# Altium schematic sheet Interface.SchDoc
size A4
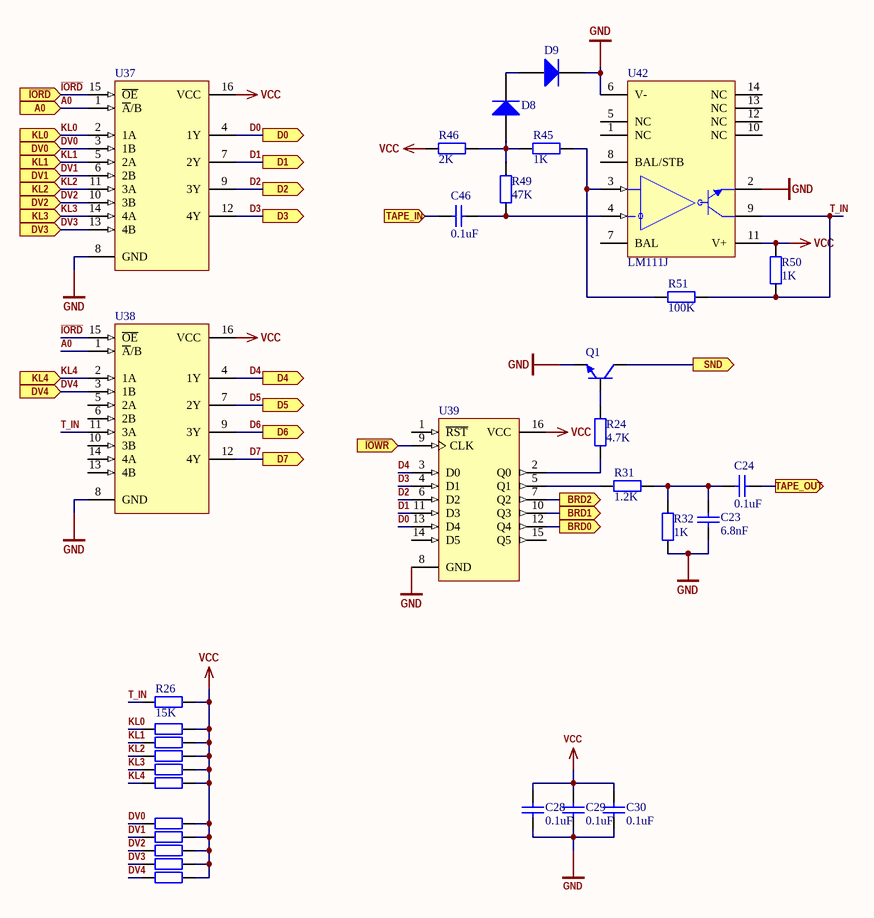
[diagram p0: Interface.SchDoc]

## Parts
C23  value 6.8nF  [RAD-0.3]  (hidden comment: Cap)
C24  value 0.1uF  [RAD-0.3]  (hidden comment: Cap)
C28  value 0.1uF  [RAD-0.3]  (hidden comment: Cap)
C29  value 0.1uF  [RAD-0.3]  (hidden comment: Cap)
C30  value 0.1uF  [RAD-0.3]  (hidden comment: Cap)
C46  value 0.1uF  [RAD-0.3]  (hidden comment: Cap)
D8  Diode 1N4148  [DO-35]  (value not drawn)
D9  Diode 1N4148  [DO-35]  (value not drawn)
Q1  KT315  [D35]  (value not drawn)
R24  value 4.7K  [AXIAL-0.4]  (hidden comment: Res2)
R26  value 15K  [AXIAL-0.4]  (hidden comment: Res2)
R27  Res2  [AXIAL-0.4]  (value not drawn)
R28  Res2  [AXIAL-0.4]  (value not drawn)
R29  Res2  [AXIAL-0.4]  (value not drawn)
R30  Res2  [AXIAL-0.4]  (value not drawn)
R31  value 1.2K  [AXIAL-0.4]  (hidden comment: Res2)
R32  value 1K  [AXIAL-0.4]  (hidden comment: Res2)
R33  Res2  [AXIAL-0.4]  (value not drawn)
R36  Res2  [AXIAL-0.4]  (value not drawn)
R38  Res2  [AXIAL-0.4]  (value not drawn)
R40  Res2  [AXIAL-0.4]  (value not drawn)
R42  Res2  [AXIAL-0.4]  (value not drawn)
R44  Res2  [AXIAL-0.4]  (value not drawn)
R45  value 1K  [AXIAL-0.4]  (hidden comment: Res2)
R46  value 2K  [AXIAL-0.4]  (hidden comment: Res2)
R49  value 47K  [AXIAL-0.4]  (hidden comment: Res2)
R50  value 1K  [AXIAL-0.4]  (hidden comment: Res2)
R51  value 100K  [AXIAL-0.4]  (hidden comment: Res2)
U37  (no value)  [N016]
U38  (no value)  [N016]
U39  (no value)  [N016]
U42  LM111J  [J014]

## Ports
A0 (in), BRD0 (out), BRD1 (out), BRD2 (out), D0 (out), D1 (out), D2 (out), D3 (out), D4 (out), D5 (out), D6 (out), D7 (out), DV0 (in), DV1 (in), DV2 (in), DV3 (in), DV4 (in), KL0 (in), KL1 (in), KL2 (in), KL3 (in), KL4 (in), SND (out), TAPE_IN (in), TAPE_OUT (out), ~{IORD} (in), ~{IOWR} (in)

## Nets
GND: C23.1 C28.1 C29.1 C30.1 D9.2(K) Q1.1(E) R32.1 U37.8(GND) U38.8(GND) U39.8(GND) U42.2(EM_OUT) U42.6(V-)
VCC: C28.2 C29.2 C30.2 R26.2 R27.2 R28.2 R29.2 R30.2 R33.2 R36.2 R38.2 R40.2 R42.2 R44.2 R46.2 R50.2 U37.16(VCC) U38.16(VCC) U39.16(VCC) U42.11(V+)
A0: U37.1(~{A}/B) U38.1(~{A}/B) ; port A0
BRD0: U39.12(Q4) ; port BRD0
BRD1: U39.10(Q3) ; port BRD1
BRD2: U39.7(Q2) ; port BRD2
D0: U37.4(1Y) U39.13(D4) ; port D0
D1: U37.7(2Y) U39.11(D3) ; port D1
D2: U37.9(3Y) U39.6(D2) ; port D2
D3: U37.12(4Y) U39.4(D1) ; port D3
D4: U38.4(1Y) U39.3(D0) ; port D4
D5: U38.7(2Y) ; port D5
D6: U38.9(3Y) ; port D6
D7: U38.12(4Y) ; port D7
DV0: R36.1 U37.3(1B) ; port DV0
DV1: R38.1 U37.6(2B) ; port DV1
DV2: R40.1 U37.10(3B) ; port DV2
DV3: R42.1 U37.13(4B) ; port DV3
DV4: R44.1 U38.3(1B) ; port DV4
~{IORD}: U37.15(~{OE}) U38.15(~{OE}) ; port ~{IORD}
~{IOWR}: U39.9(CLK) ; port ~{IOWR}
KL0: R27.1 U37.2(1A) ; port KL0
KL1: R28.1 U37.5(2A) ; port KL1
KL2: R29.1 U37.11(3A) ; port KL2
KL3: R30.1 U37.14(4A) ; port KL3
KL4: R33.1 U38.2(1A) ; port KL4
SND: Q1.2(C) ; port SND
T_IN: R26.1 R50.1 R51.1 U38.11(3A) U42.9(COL_OUT)
TAPE_IN: C46.1 ; port TAPE_IN
TAPE_OUT: C24.1 ; port TAPE_OUT
NetC23_2: C23.2 C24.2 R31.2 R32.2
NetC46_2: C46.2 R49.1 U42.4(IN-)
NetD8_1: D8.1(A) R45.2 R46.1 R49.2
NetD8_2: D8.2(K) D9.1(A)
NetQ1_3: Q1.3(B) R24.2
NetR24_1: R24.1 U39.2(Q0)
NetR31_1: R31.1 U39.5(Q1)
NetR45_1: R45.1 R51.2 U42.3(IN+)

Not connected (* = marked no-connect by the designer): U38 5(2A) 6(2B) 10(3B) 13(4B) 14(4A); U39 1(~{RST}) 14(D5) 15(Q5); U42 1(NC) 5(NC) 7(BAL) 8(BAL/STB) 10(NC) 12(NC) 13(NC) 14(NC)

## Library data of the parts
C23 C24 C28-C30 C46 = Cap: Capacitor; Published: 8-Jun-2000; LatestRevisionDate: 17-Jul-2002; LatestRevisionNote: Re-released for DXP Platform.; PackageReference: RAD-0.3; Publisher: Altium Limited; PackageDescription: Radial Cap, Thru-Hole; 2 Leads; 0.3 in Pin Spacing
D8 D9 = Diode 1N4148: High Conductance Fast Diode; Published: 8-Jun-2000; LatestRevisionDate: 17-Jul-2002; LatestRevisionNote: Re-released for DXP Platform.; DatasheetVersion: 1997; PackageReference: DO-35; Publisher: Altium Limited; PackageDescription: Diode, Axial; Body 3.8 x 1.9 mm (LxDia. max), Lead Dia. 0.53 mm (max); Code_JEDEC: DO-204-AH; ComponentLink1Description: Manufacturer Link; ComponentLink1URL: http://www.fairchildsemi.com/; ComponentLink2Description: Datasheet; ComponentLink2URL: http://www.fairchildsemi.com/ds/1N%2F1N4148.pdf
Q1 = KT315: NPN General Purpose Amplifier; Published: 8-Jun-2000; LatestRevisionDate: 15-Jan-2003; LatestRevisionNote: PCB Footprint 'BCY-W3/D4.7' replaced; DatasheetVersion: 1997; PackageVersion: Sep-1998; PackageReference: TO-92A; Publisher: Altium Limited; PackageDescription: TO, Flat Index; 3 In-Line, Axial Leads; Body Dia. 4.5mm; Leads 0.51 x 0.48 mm (max); ComponentLink1Description: Manufacturer Link; ComponentLink1URL: http://www.fairchildsemi.com/; ComponentLink2Description: Datasheet; ComponentLink2URL: http://www.fairchildsemi.com/ds/2N%2F2N3904.pdf
R24 R26 R31 R32 R45 R46 R49-R51 = Res2: Resistor; Published: 8-Jun-2000; LatestRevisionDate: 17-Jul-2002; LatestRevisionNote: Re-released for DXP Platform.; PackageReference: AXIAL-0.4; Publisher: Altium Limited; PackageDescription: Axial Device, Thru-Hole; 2 Leads; 0.4 in Pin Spacing
R27-R30 R33 R36 R38 R40 R42 R44 = Res2: Resistor; Value: 15K; Published: 8-Jun-2000; LatestRevisionDate: 17-Jul-2002; LatestRevisionNote: Re-released for DXP Platform.; PackageReference: AXIAL-0.4; Publisher: Altium Limited; PackageDescription: Axial Device, Thru-Hole; 2 Leads; 0.4 in Pin Spacing
U37 U38 = SN74HC257N: Quadruple 2-Line to 1-Line Data Selector/Multiplexer with 3-State Outputs; Published: 8-Jun-2000; LatestRevisionDate: 04-Mar-2005; LatestRevisionNote: Stylized 3D Model Added.; DatasheetVersion: Jun-1989; PackageVersion: Oct-1995; PackageReference: N016; Publisher: Altium Limited; PackageDescription: DIP; 16 Leads; Row Spacing 7.62 mm; Pitch 2.54 mm; Code_JEDEC: MS-001-BB; ComponentLink1Description: Manufacturer Link; ComponentLink1URL: http://www.ti.com/; ComponentLink2Description: Datasheet; ComponentLink2URL: http://www-s.ti.com/sc/ds/sn74hc257.pdf
U39 = SN74HC174N: Hex D-Type Flip-Flop with Clear; Published: 8-Jun-2000; LatestRevisionDate: 04-Mar-2005; LatestRevisionNote: Stylized 3D Model Added.; DatasheetVersion: May-1997; PackageVersion: Oct-1995; PackageReference: N016; Publisher: Altium Limited; PackageDescription: DIP; 16 Leads; Row Spacing 7.62 mm; Pitch 2.54 mm; Code_JEDEC: MS-001-BB; ComponentLink1Description: Manufacturer Link; ComponentLink1URL: http://www.ti.com/; ComponentLink2Description: Datasheet; ComponentLink2URL: http://www-s.ti.com/sc/ds/sn74hc174.pdf
U42 = LM111J: Differential Comparator with Strobe; Note: Pins 1, 5, 10, 12, 13 and 14 are NC pins.; Published: 16-Jan-2001; LatestRevisionDate: 20-Jul-2007; LatestRevisionNote: Sch Symbol changed.; DatasheetVersion: Feb-1992; PackageVersion: Jun-1999; PackageReference: J014; Publisher: Altium Limited; PackageDescription: DIP; 14 Leads; Row Spacing 7.62 mm; Pitch 2.54 mm; ComponentLink1Description: Manufacturer Link; ComponentLink1URL: http://www.ti.com/; ComponentLink2Description: Datasheet; ComponentLink2URL: http://www-s.ti.com/sc/ds/lm111.pdf